# EAGLE design LeonardoCard (EAGLE 6.4)
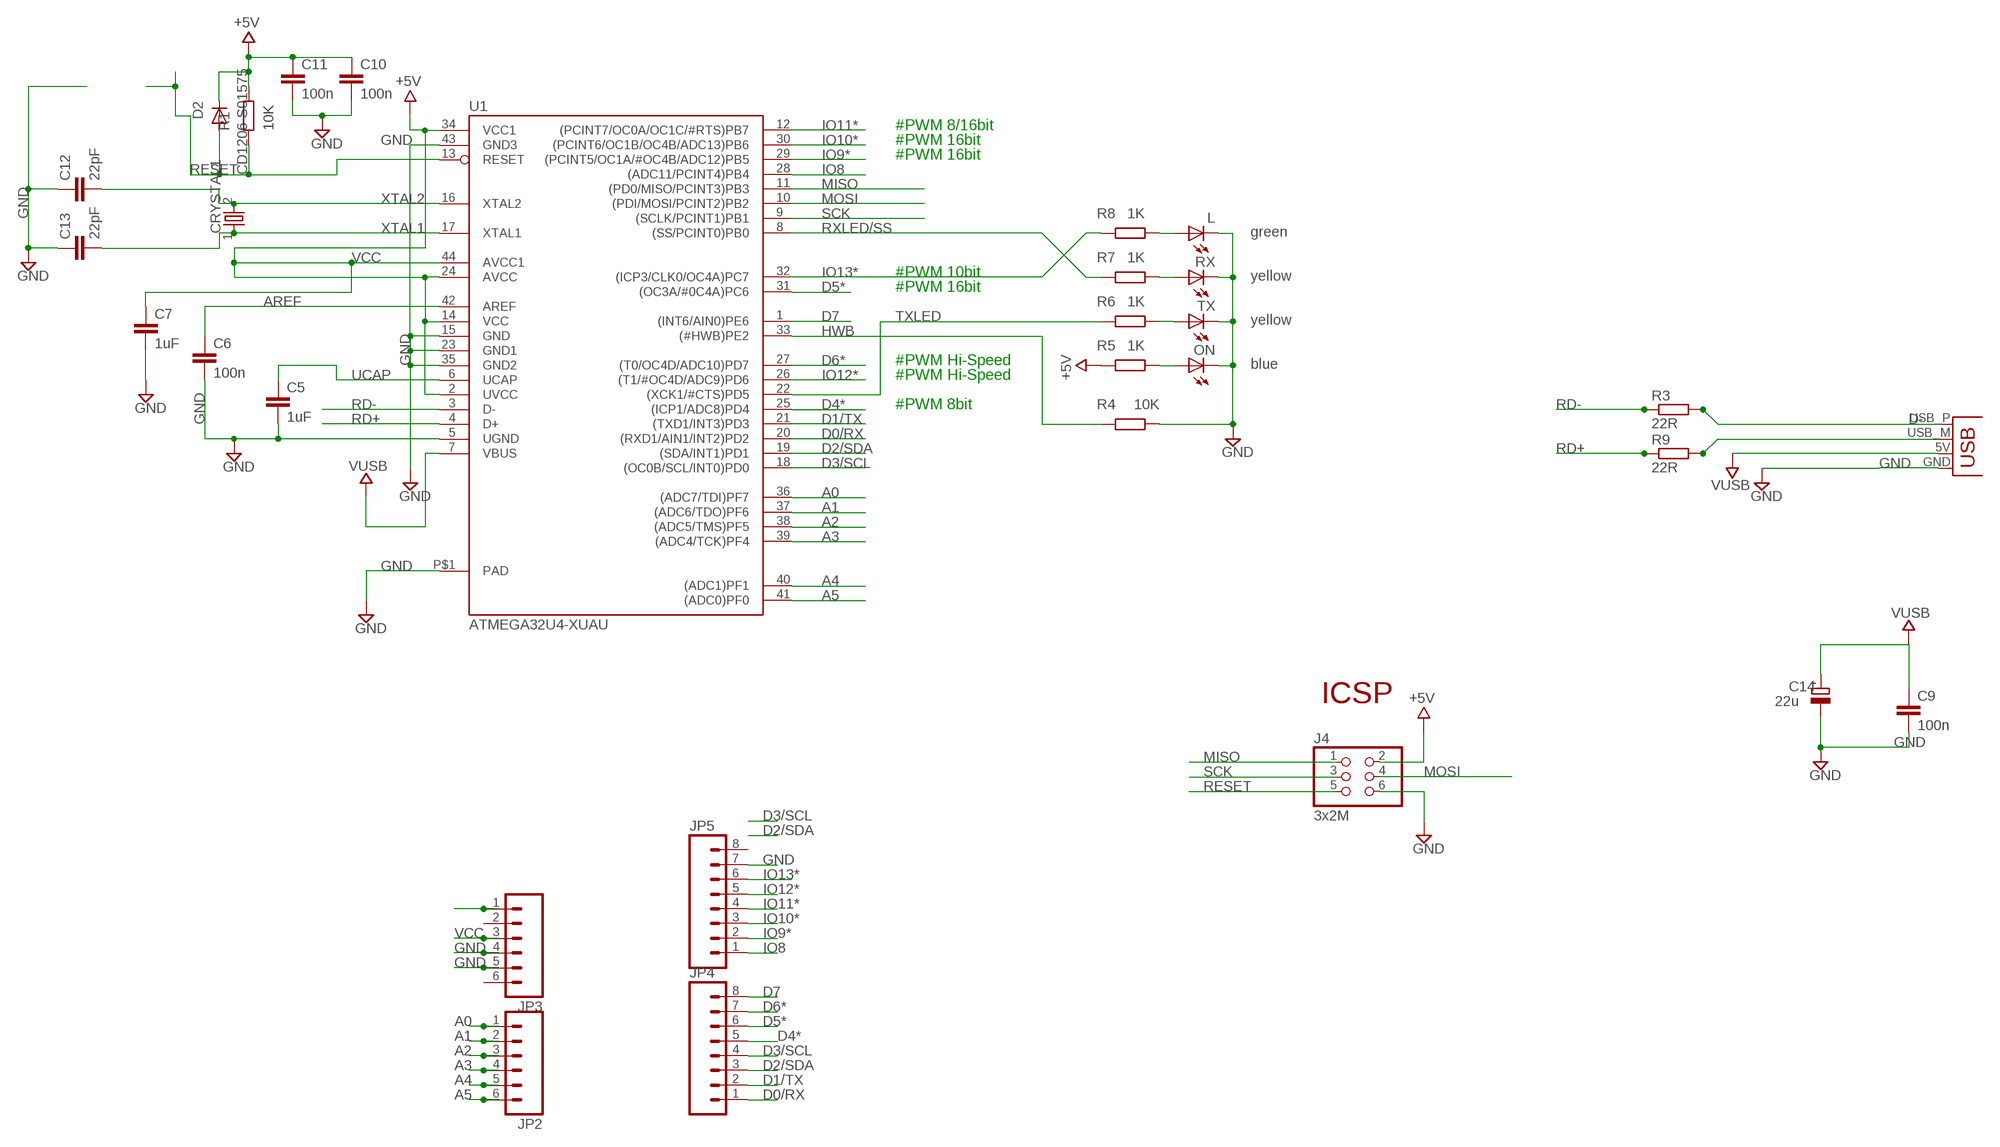
[diagram p0: schematic, sheet 1]

## Parts
C5  1uF  C-EUC1206  [C1206]
C6  100n  C-EUC1206  [C1206]
C7  1uF  C-EUC1206  [C1206]
C9  100n  C-EUC1206  [C1206]
C10  100n  C-EUC1206  [C1206]
C11  100n  C-EUC1206  [C1206]
C12  22pF  C-EUC1206  [C1206]
C13  22pF  C-EUC1206  [C1206]
C14  22u  CPOL-EUSANYO_SMD_B6  [SANYO-OSCON_SMD_B6]
CRYSTAL1  CRYSTAL2PIN  [CRYSTAL-2PIN]
D2  CD1206-S01575  DIODE-SOD80C  [SOD80C]
J4  3x2M  PINHD-2X3  [2X03]
JP1  USBPCB  [USB-A-PCB]
JP2  M06SIP  [1X06]
JP3  M06SIP  [1X06]
JP4  M08NO_SILK  [1X08_NO_SILK]
JP5  M08NO_SILK  [1X08_NO_SILK]
L  green  LEDCHIPLED_1206  [CHIPLED_1206]
ON  blue  LEDCHIPLED_1206  [CHIPLED_1206]
R1  10K  R-EU_R1206  [R1206]
R3  22R  R-EU_R1206  [R1206]
R4  10K  R-EU_R1206  [R1206]
R5  1K  R-EU_R1206  [R1206]
R6  1K  R-EU_R1206  [R1206]
R7  1K  R-EU_R1206  [R1206]
R8  1K  R-EU_R1206  [R1206]
R9  22R  R-EU_R1206  [R1206]
RX  yellow  LEDCHIPLED_1206  [CHIPLED_1206]
TX  yellow  LEDCHIPLED_1206  [CHIPLED_1206]
U1  ATMEGA32U4-XUAU  [TQFP44-PAD]

## Nets
A0: JP2.1 U1.36((ADC7/TDI)PF7)
A1: JP2.2 U1.37((ADC6/TDO)PF6)
A2: JP2.3 U1.38((ADC5/TMS)PF5)
A3: JP2.4 U1.39((ADC4/TCK)PF4)
A4: JP2.5 U1.40((ADC1)PF1)
A5: JP2.6 U1.41((ADC0)PF0)
AREF: C6.1 U1.42(AREF)
D0/RX: JP4.1 U1.20((RXD1/AIN1/INT2)PD2)
D1/TX: JP4.2 U1.21((TXD1/INT3)PD3)
D2/SDA: JP4.3 U1.19((SDA/INT1)PD1)
D3/SCL: JP4.4 U1.18((OC0B/SCL/INT0)PD0)
D4*: JP4.5 U1.25((ICP1/ADC8)PD4)
D5*: JP4.6 U1.31((OC3A/#0C4A)PC6)
D6*: JP4.7 U1.27((T0/OC4D/ADC10)PD7)
D7: JP4.8 U1.1((INT6/AIN0)PE6)
D+: JP1.USB_M(D-) R9.2
D-: JP1.USB_P(D+) R3.2
GND: C5.2 C6.2 C7.2 C9.2 C10.2 C11.2 C12.1 C13.1 C14.- J4.6 JP1.GND JP3.4 JP3.5 JP5.7 L.C ON.C R4.2 RX.C TX.C U1.5(UGND) U1.15(GND) U1.23(GND1) U1.35(GND2) U1.43(GND3) U1.P$1(PAD)
HWB: R4.1 U1.33((#HWB)PE2)
IO8: JP5.1 U1.28((ADC11/PCINT4)PB4)
IO9*: JP5.2 U1.29((PCINT5/OC1A/#OC4B/ADC12)PB5)
IO10*: JP5.3 U1.30((PCINT6/OC1B/OC4B/ADC13)PB6)
IO11*: JP5.4 U1.12((PCINT7/OC0A/OC1C/#RTS)PB7)
IO12*: JP5.5 U1.26((T1/#OC4D/ADC9)PD6)
IO13*: JP5.6 R8.1 U1.32((ICP3/CLK0/OC4A)PC7)
MISO: J4.1 U1.11((PD0/MISO/PCINT3)PB3)
MOSI: J4.4 U1.10((PDI/MOSI/PCINT2)PB2)
N$2: R7.2 RX.A
N$3: ON.A R5.2
N$4: R6.2 TX.A
N$7: L.A R8.2
RD+: R9.1 U1.4(D+)
RD-: R3.1 U1.3(D-)
RESET: D2.A J4.5 JP3.1 R1.2 U1.13(RESET)
RXLED/SS: R7.1 U1.8((SS/PCINT0)PB0)
SCK: J4.3 U1.9((SCLK/PCINT1)PB1)
TXLED: R6.1 U1.22((XCK1/#CTS)PD5)
UCAP: C5.1 U1.6(UCAP)
VCC: C7.1 C9.1 C10.1 C11.1 C14.+ D2.C J4.2 JP1.5V(VBUS) JP3.3 R1.1 R5.1 U1.2(UVCC) U1.14(VCC) U1.24(AVCC) U1.34(VCC1) U1.44(AVCC1) ; supply symbol labelled VUSB, +5V
VUSB: U1.7(VBUS)
XTAL1: C13.2 CRYSTAL1.1 U1.17(XTAL1)
XTAL2: C12.2 CRYSTAL1.2 U1.16(XTAL2)
Unconnected: JP3.2 JP3.6 JP5.8

## Notes on the sheet
- #PWM 8/16bit
- #PWM 16bit
- #PWM 16bit
- #PWM 10bit
- #PWM 16bit
- #PWM Hi-Speed
- #PWM Hi-Speed
- #PWM 8bit
- ICSP

## Library data of the parts
C5-C7 C9-C13 = SmartPrj:C-EU: CAPACITOR, European symbol
C14 = rcl:CPOL-EU: POLARIZED CAPACITOR, European symbol
CRYSTAL1 = BaseApp:CRYSTAL: CRYSTAL SMD-10.5X4.8-2PIN :- http://www.digikey.com/product-detail/en/CX49GFNB12000H0PESZZ/478-4349-1-ND/1532102 SMD-5X3- 4PIN :- 535-11281-1-ND
D2 = diode:DIODE-: DIODE
J4 = SmartPrj:PINHD-2X3: PIN HEADER
JP1 = SparkFun-Connectors:USB: USB Connectors USB-B-PTH is fully proven SKU : PRT-00139/CONN-08278 USB-miniB is fully proven SKU : PRT-00587 USB-A-PCB is untested. USB-A-H is throughly reviewed, but untested. Spark Fun Electronics SKU : PRT-00437 USB-B-SMT is throughly reviewed, but untested. Needs silkscreen touching up. USB-A-S has not been used/tested USB-MB-H has not been used/tested USB-MICROB has been used. CONN-09505
JP2 JP3 = SparkFun-Connectors:M06: Header 6 Standard 6-pin 0.1" header. Use with straight break away headers (SKU : PRT-00116), right angle break away headers (PRT-00553), swiss pins (PRT-00743), machine pins (PRT-00117), and female headers (PRT-00115). Molex polarized connector foot print use with SKU : PRT-08094 with associated crimp pins and housings. NOTES ON THE VARIANTS LOCK and LOCK_LONGPADS... This footprint was designed to help hold the alignment of a through-hole component (i.e. 6-pin header) while soldering it into place. You may notice that each hole has been shifted either up or down by 0.005 of an inch from it's more standard position (which is a perfectly straight line). This slight alteration caused the pins (the squares in the middle) to touch the edges of the holes. Because they are alternating, it causes a "brace" to hold the component in place. 0.005 has proven to be the perfect amount of "off-center" position when using our standard breakaway headers. Although looks a little odd when you look at the bare footprint, once you have a header in there, the alteration is very hard to notice. Also,if you push a header all the way into place, it is covered up entirely on the bottom side. This idea of altering the position of holes to aid alignment will be further integrated into the Sparkfun Library for other footprints. It can help hold any component with 3 or more connection pins.
JP4 JP5 = SparkFun-Connectors:M08: Header 8 Standard 8-pin 0.1" header. Use with straight break away headers (SKU : PRT-00116), right angle break away headers (PRT-00553), swiss pins (PRT-00743), machine pins (PRT-00117), and female headers (PRT-00115).
L ON RX TX = led:LED: LED OSRAM: - CHIPLED LG R971, LG N971, LY N971, LG Q971, LY Q971, LO R971, LY R971 LH N974, LH R974 LS Q976, LO Q976, LY Q976 LO Q996 - Hyper CHIPLED LW Q18S LB Q993, LB Q99A, LB R99A - SideLED LS A670, LO A670, LY A670, LG A670, LP A670 LB A673, LV A673, LT A673, LW A673 LH A674 LY A675 LS A676, LA A676, LO A676, LY A676, LW A676 LS A679, LY A679, LG A679 - Hyper Micro SIDELED® LS Y876, LA Y876, LO Y876, LY Y876 LT Y87S - SmartLED LW L88C, LW L88S LB L89C, LB L89S, LG L890 LS L89K, LO L89K, LY L89K LS L896, LA L896, LO L896, LY L896 - TOPLED LS T670, LO T670, LY T670, LG T670, LP T670 LSG T670, LSP T670, LSY T670, LOP T670, LYG T670 LG T671, LOG T671, LSG T671 LB T673, LV T673, LT T673, LW T673 LH T674 LS T676, LA T676, LO T676, LY T676, LB T676, LH T676, LSB T676, LW T676 LB T67C, LV T67C, LT T67C, LS T67K, LO T67K, LY T67K, LW E67C LS E67B, LA E67B, LO E67B, LY E67B, LB E67C, LV E67C, LT E67C LW T67C LS T679, LY T679, LG T679 LS T770, LO T770, LY T770, LG T770, LP T770 LB T773, LV T773, LT T773, LW T773 LH T774 LS E675, LA E675, LY E675, LS T675 LS T776, LA T776, LO T776, LY T776, LB T776 LHGB T686 LT T68C, LB T68C - Hyper Mini TOPLED® LB M676 - Mini TOPLED Santana® LG M470 LS M47K, LO M47K, LY M47K Source: http://www.osram.convergy.de LUXEON: - LUMILED® LXK2-PW12-R00, LXK2-PW12-S00, LXK2-PW14-U00, LXK2-PW14-V00 LXK2-PM12-R00, LXK2-PM12-S00, LXK2-PM14-U00 LXK2-PE12-Q00, LXK2-PE12-R00, LXK2-PE12-S00, LXK2-PE14-T00, LXK2-PE14-U00 LXK2-PB12-K00, LXK2-PB12-L00, LXK2-PB12-M00, LXK2-PB14-N00, LXK2-PB14-P00, LXK2-PB14-Q00 LXK2-PR12-L00, LXK2-PR12-M00, LXK2-PR14-Q00, LXK2-PR14-R00 LXK2-PD12-Q00, LXK2-PD12-R00, LXK2-PD12-S00 LXK2-PH12-R00, LXK2-PH12-S00 LXK2-PL12-P00, LXK2-PL12-Q00, LXK2-PL12-R00 Source: www.luxeon.com KINGBRIGHT: KA-3528ASYC Source: www.kingbright.com
R1 R4-R8 = SmartPrj:R-EU_: RESISTOR, European symbol
R3 R9 = resistor:R-EU_: RESISTOR, European symbol
U1 = SmartPrj:ATMEGA32U4-XU

## Net classes
0 default: width 0.254 mm, drill 0.61 mm, clearance 0.203 mm

## Board
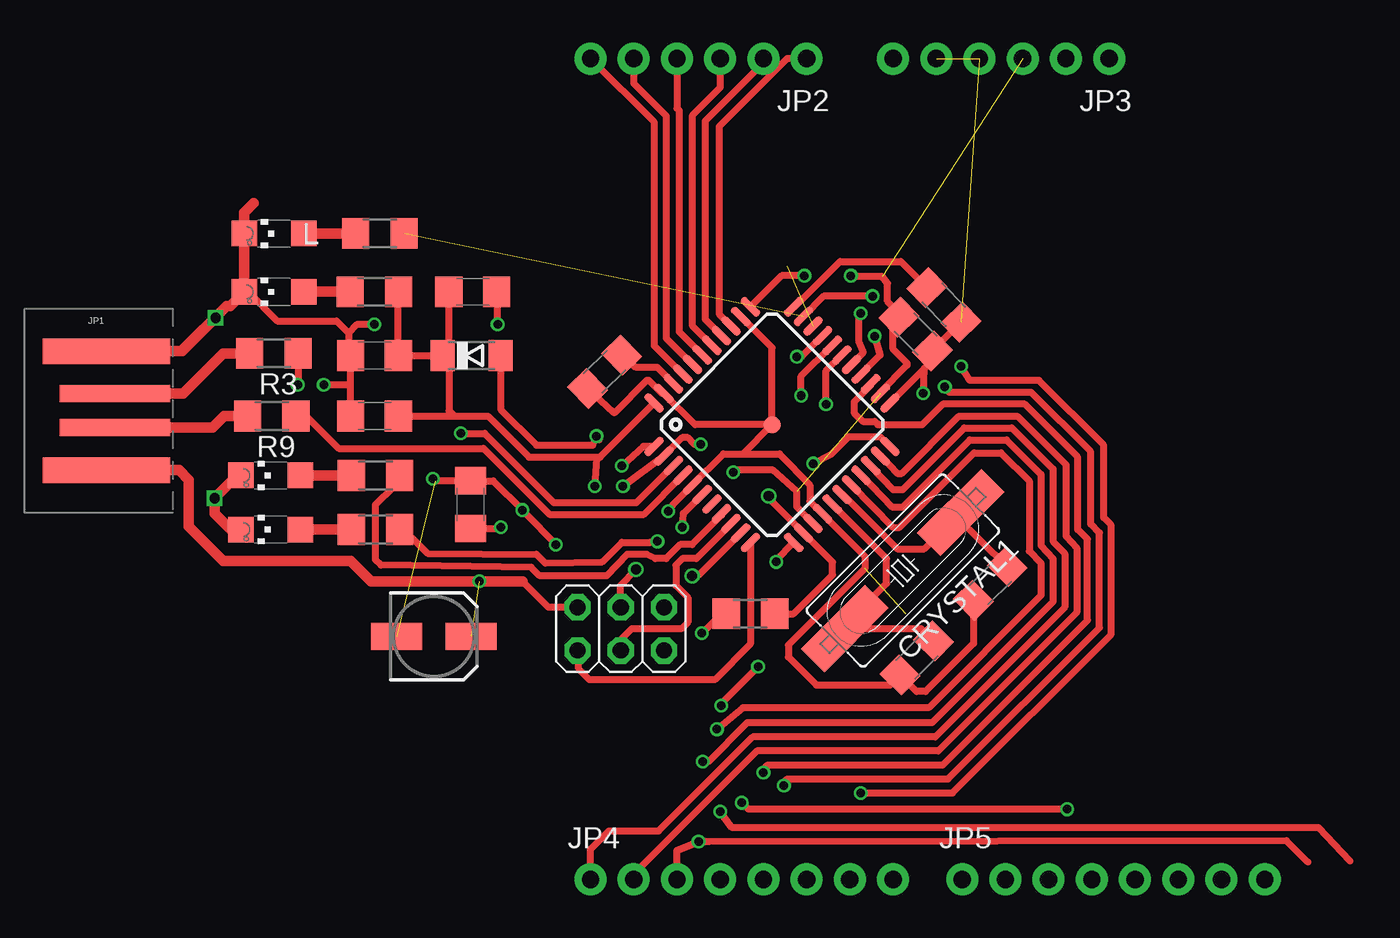
[diagram p1: board, top side]
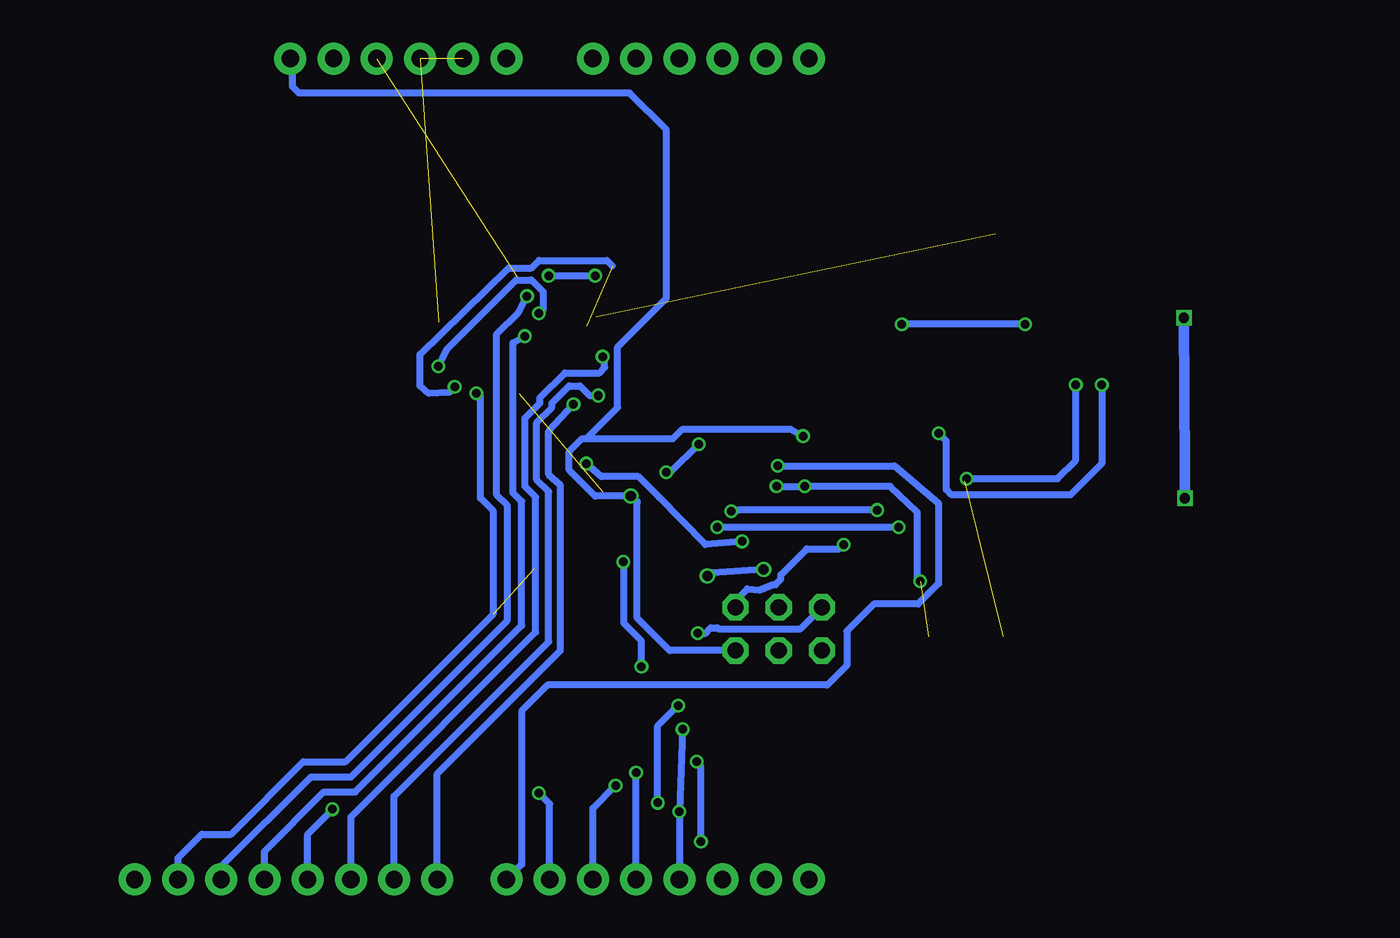
[diagram p2: board, bottom side, seen from below]

No outline drawn. Coordinates in mm, seen from the top.
Copper layers (1*16): Top 0.035mm / dielectric 1.5mm / Bottom 0.035mm
Design rules "dirt_cheap_dirty_boards.v1": minimum track width 5mil, minimum drill 12mil, track to track 5mil, track to pad 5mil, pad to pad 5mil, via to via 5mil, smd to smd 0mil, copper to edge 10mil, drill to drill 10mil, minimum pad ring 10mil, minimum via ring 6mil, stop-mask expansion 2mil, vias tented up to drill 25mil, thermal gap 10mil

### Footprints (pad centres in the part's own frame; a part is rotated, then mirrored left to right if it is on the bottom)
C1206 = smd 1.6 x 1.8: 1 -1.4,0; 2 1.4,0
SANYO-OSCON_SMD_B6 = smd 3 x 1.6: + 2.2,0; - -2.2,0
CRYSTAL-2PIN = smd 5.334 x 1.93: 1 -4.826,0; 2 4.826,0
SOD80C = smd 1.4 x 1.8: A 1.7,0; C -1.7,0
2X03 = drill 0.95 pad 1.55 octagon: 1 -2.54,-1.27; 2 -2.54,1.27; 3 0,-1.27; 4 0,1.27; 5 2.54,-1.27; 6 2.54,1.27
USB-A-PCB = smd 7.5 x 1.5: 5V -0.2,-3.5; GND -0.2,3.5 | smd 6.5 x 1: USB_M 0.3,-1; USB_P 0.3,1
1X06 = drill 1.016 pad 1.88: 1 0,0; 2 2.54,0; 3 5.08,0; 4 7.62,0; 5 10.16,0; 6 12.7,0
1X08_NO_SILK = drill 1.016 pad 1.88: 1 0,0; 2 2.54,0; 3 5.08,0; 4 7.62,0; 5 10.16,0; 6 12.7,0; 7 15.24,0; 8 17.78,0
CHIPLED_1206 = smd 1.5 x 1.5: A 0,-1.75; C 0,1.75
R1206 = smd 1.6 x 1.803: 1 -1.422,0; 2 1.422,0
TQFP44-PAD = smd 1.4 x 0.45: 1 -5.8,4; 2 -5.8,3.2; 3 -5.8,2.4; 4 -5.8,1.6; 5 -5.8,0.8; 6 -5.8,0; 7 -5.8,-0.8; 8 -5.8,-1.6; 9 -5.8,-2.4; 10 -5.8,-3.2; 11 -5.8,-4; 23 5.8,-4; 24 5.8,-3.2; 25 5.8,-2.4; 26 5.8,-1.6; 27 5.8,-0.8; 28 5.8,0; 29 5.8,0.8; 30 5.8,1.6; 31 5.8,2.4; 32 5.8,3.2; 33 5.8,4 | smd 0.45 x 1.4: 12 -4,-5.8; 13 -3.2,-5.8; 14 -2.4,-5.8; 15 -1.6,-5.8; 16 -0.8,-5.8; 17 0,-5.8; 18 0.8,-5.8; 19 1.6,-5.8; 20 2.4,-5.8; 21 3.2,-5.8; 22 4,-5.8; 34 4,5.8; 35 3.2,5.8; 36 2.4,5.8; 37 1.6,5.8; 38 0.8,5.8; 39 0,5.8; 40 -0.8,5.8; 41 -1.6,5.8; 42 -2.4,5.8; 43 -3.2,5.8; 44 -4,5.8 | smd 1 x 1: P$1 0,0

### Placement (x,y rotation side)
C5  -45.15,13.21 90 top
C6  -37.27,21.02 224.5 top
C7  -50.8,18.41 180 top
C9  -18.99,23.24 314.6 top
C10  -45.02,25.72 0 top
C11  -50.8,21.97 180 top
C12  -18.92,4.19 45.4 top
C13  -14.61,8.57 45 top
C14  -47.31,5.46 0 top
CRYSTAL1  -19.75,9.33 225 top
D2  -45.09,21.97 0 top
J4  -36.32,5.91 0 top
JP1  -66.36,18.73 0 top
JP2  -25.4,39.43 180 top
JP3  -7.62,39.43 180 top
JP4  -38.1,-8.83 0 top
JP5  -16.26,-8.83 0 top
L  -56.71,29.15 90 top
ON  -56.71,25.72 90 top
R1  -28.7,6.79 0 top
R3  -56.71,22.1 180 top
R4  -17.34,24.96 314.5 top
R5  -50.8,25.72 180 top
R6  -50.74,11.75 180 top
R7  -50.74,14.92 180 top
R8  -50.48,29.15 180 top
R9  -56.83,18.41 180 top
RX  -56.9,14.92 90 top
TX  -56.9,11.75 90 top
U1  -27.43,17.91 45 top

### Tracks (layer width: path | path; a pad name or v marks a point on that pad's centre or on a via)
A0
  Top 0.406: JP2.1 -26.54,39.43 -30.54,35.43 -30.54,24.41 U1.36
A1
  Top 0.406: JP2.2 -27.94,39.18 -31.37,35.75 -31.37,24.11 U1.37
A2
  Top 0.406: JP2.3 -30.48,37.72 -32.13,36.07 -32.13,23.74 U1.38
A3
  Top 0.406: JP2.4 -33.02,36.51 -32.89,36.39 -32.89,23.37 U1.39
A4
  Top 0.406: JP2.5 -35.56,37.97 -33.66,36.07 -33.66,23 U1.40
A5
  Top 0.406: U1.41 -32.69,20.88 -34.35,22.54 -34.35,35.69 JP2.6
AREF
  Top 0.406: U1.42 -33.23,20.34 -34.16,21.27 -35.42,21.27 C6.1
D0/RX
  Top 0.406: U1.20 -21.63,15.47 -20.32,14.1 -19.75,14.1 -16.13,17.72 -13.34,17.72 -10.92,15.3 -10.92,11.05 -10.22,10.35 -10.22,7.18 -17.84,-0.45 -28.57,-0.45 -34.1,-5.97 -37.02,-5.97 -38.1,-7.05 JP4.1
D1/TX
  Top 0.406: U1.21 -21.02,16.07 -20.07,15.05 -19.81,15.05 -16.45,18.41 -13.02,18.41 -10.16,15.56 -10.16,11.37 -9.53,10.67 -9.53,6.86 -17.65,-1.27 -28.32,-1.27 -35.56,-8.51 JP4.2
D2/SDA  (via drill 0.5)
  Top 0.406: U1.19 -22.18,14.94 -20.38,13.08 -19.75,13.08 -15.81,17.02 -13.65,17.02 -11.62,14.99 -11.62,10.79 -10.92,10.03 -10.92,7.49 -18.03,0.38 -28.89,0.38 -31.18,-1.91 v-31.5,-1.91 | JP4.3 -33.02,-7.11 v-31.75,-6.6 -31.11,-6.6 2.79,-6.54 4.06,-7.81
  Bottom 0.406: v-31.75,-6.6 -31.75,-2.16 v-31.5,-1.91
D3/SCL  (via drill 0.5)
  Top 0.406: U1.18 -22.75,14.37 -20.32,11.87 -19.94,11.87 -15.56,16.26 -13.97,16.26 -12.32,14.61 -12.32,10.48 -11.62,9.78 -11.62,7.87 -18.22,1.27 -29.15,1.27 v-30.67,0 | 6.54,-7.75 4.7,-5.78 -29.78,-5.78 v-30.48,-4.83
  Bottom 0.406: v-30.67,0 v-30.48,-4.83 JP4.4
D4*  (via drill 0.5)
  Top 0.406: v-27.94,-2.54 -27.94,-2.35 -27.69,-2.1 -17.4,-2.1 -8.89,6.41 -8.89,11.18 -9.46,11.75 -9.46,16 -12.57,19.11 -17.4,19.11 -18.61,17.91 -21.21,17.91 -21.4,18.1 -22.1,18.1 -22.61,18.61 -22.61,19.24 -21.63,20.21 U1.25
  Bottom 0.406: JP4.5 v-27.94,-2.54
D5*  (via drill 0.5)  (1 unrouted)
  Top 0.406: v-26.73,-3.3 -26.73,-3.11 -26.54,-2.92 -17.08,-2.92 -8.19,5.97 -8.19,11.56 -8.7,12.06 -8.7,16.32 -12.19,19.81 -17.02,19.81 v-17.27,20.13
  Bottom 0.406: JP4.6 -25.4,-4.64 v-26.73,-3.3 | v-17.27,20.13 -16.95,19.81 -15.75,19.75 -15.24,20.19 -15.24,22.04 -20.45,27.11 -21.78,27.11 -22.23,27.56 -26.23,27.56 -26.54,27.24
D6*  (via drill 0.5)
  Top 0.406: v-22.23,-3.75 -16.83,-3.75 -7.49,5.59 -7.49,12 -7.94,12.45 -7.94,16.7 -11.75,20.51 -15.81,20.51 v-16.32,21.34 | v-22.23,24.45 -22.23,24.32 -22.35,24.13 -22.35,22.86 -22.1,22.23 -22.1,22.11 U1.27
  Bottom 0.406: JP4.7 -22.86,-4.38 v-22.23,-3.75 | v-16.32,21.34 -16.83,22.35 -20.89,26.42 -21.78,26.42 -22.48,25.72 -22.48,24.7 v-22.23,24.45
D7  (via drill 0.5)
  Top 0.406: U1.1 -34.99,16.63 v-36.26,15.49
  Bottom 0.406: v-36.26,15.49 -43.12,15.49 -45.72,13.27 -45.72,8.57 -44.51,7.37 -41.91,7.37 -40.32,5.78 -40.32,3.75 -39.18,2.6 -22.73,2.6 -21.21,1.08 -21.21,-7.94 JP4.8
D+
  Top 0.61: JP1.USB_M -60.31,17.73 -59.63,18.41 R9.2
D-
  Top 0.61: JP1.USB_P -62.06,19.73 -59.69,22.1 R3.2
GND  (via drill 0.5, 0.6)  (4 unrouted)
  Top 0.406: C13.1 -15.6,5.04 -18.41,2.22 -18.93,2.22 C12.1 -20.5,2.6 -24.83,2.6 -26.48,4.25 -26.48,4.95 -21.97,9.46 -21.97,10.16 -24.46,12.65 U1.15 -24.48,12.67 -25.21,13.4 -25.21,14.35 -26.99,16.19 -29.15,16.19 | U1.23 -18.48,21.21 | -18.03,22.08 -18.03,21.65 -18.48,21.21 | -18.03,22.08 C9.2 | U1.P$1 -27.43,22.43 U1.35 | U1.P$1 -31.96,17.91 U1.43 -33.91,19.75 -34.67,20.51 -34.8,20.51 -36.7,18.61 -36.71,18.61 C6.2 | -29.15,16.19 -30.29,16.19 -32.1,14.38 U1.5 -33.24,13.23 v-33.53,12.81 | -29.15,16.19 U1.P$1 | -18.03,22.08 -18.03,22.25 R4.2 | ON.C -58.23,25.72 -56.52,24 -53.02,24 -52.32,23.3 | -52.32,23.3 -52.32,22.09 C11.2 -52.2,20.26 | C7.2 -52.2,20.26 | v-47.37,14.73 -47.25,14.61 C5.2 -43.82,14.61 v-42.1,12.89 -41.91,12.7 v-40.13,10.86 | v-53.78,20.26 -52.2,20.26 | -52.32,23.3 -51.82,23.81 v-50.8,23.81 | v-43.56,23.81 -43.56,25.66 C10.2 | v-18.54,19.75 -18.48,21.21
  Top 0.61: v-60.13,24.19 -62.1,22.23 JP1.GND -62.16,22.23 -59.5,24.89 -59.28,24.89 ON.C L.C -58.46,30.38 -57.91,30.92 | TX.C -58.71,11.68 -59.18,11.68 -60.2,12.7 v-60.2,13.59 -58.86,14.92 RX.C
  Bottom 0.406: v-47.37,14.73 -52.7,14.73 -53.78,15.81 v-53.78,20.26 | v-42.1,12.89 -33.98,12.89 v-33.53,12.81 | v-50.8,23.81 v-43.56,23.81 | J4.6 -33.78,7.56 -34.48,8.26 -35.18,8.19 -36.01,8.51 -36.13,8.51 -36.45,8.83 -36.45,9.08 -37.97,10.6 -39.88,10.6 v-40.13,10.86 | JP5.7 -1.02,-7.56 -2.41,-6.16 -4.13,-6.16 -8.38,-1.91 -10.86,-1.91 -19.56,6.79 -19.56,12.83 -18.8,13.59 -18.8,19.68 v-18.54,19.75
  Bottom 0.61: v-60.13,24.19 -60.2,15.37 v-60.2,13.59
HWB
  Top 0.406: U1.33 -26.09,24.84 -23.43,27.5 -19.86,27.5 R4.1
IO8  (via drill 0.5)
  Top 0.406: v-24.26,19.11 -24.26,21.08 U1.28
  Bottom 0.406: JP5.1 -16.26,-2.6 -23.5,4.64 -23.5,14.35 -22.8,14.99 -22.8,17.53 v-24.26,19.11
IO9*  (via drill 0.5)
  Top 0.406: v-25.72,19.62 -25.72,20.75 U1.29
  Bottom 0.406: JP5.2 -13.72,-3.94 -22.8,5.14 -22.8,13.97 -22.1,14.67 -22.1,18.03 -22.99,18.92 -22.99,19.18 -24,20.19 -24.64,20.19 -25.21,19.62 v-25.72,19.62
IO10*  (via drill 0.5)
  Top 0.406: v-25.97,21.91 -25.69,21.91 U1.30
  Bottom 0.406: JP5.3 -11.18,-5.14 -22.04,5.71 -22.04,13.65 -21.4,14.29 -21.4,18.29 -22.29,19.18 -22.29,19.49 -23.75,20.95 -25.78,20.95 -26.1,21.27 -26.1,21.78 v-25.97,21.91
IO11*  (via drill 0.5)
  Top 0.406: v-10.1,-4.7 -28.83,-4.7 v-29.21,-4.32 | v-30.42,1.4 -30.42,1.52 v-28.26,3.68 | v-27.18,9.84 -27.18,9.96 U1.12
  Bottom 0.406: JP5.4 -8.64,-6.16 v-10.1,-4.7 | v-29.21,-4.32 -29.21,0.19 v-30.42,1.4 | v-28.26,3.68 -28.26,5.21 -27.24,6.22 -27.24,9.78 v-27.18,9.84
IO12*  (via drill 0.5)
  Top 0.406: v-21.4,23.11 -21.08,21.99 U1.26
  Bottom 0.406: JP5.5 -6.1,-7.18 -9.59,-3.68 -11.43,-3.68 -21.21,6.1 -21.21,13.4 -20.7,13.91 -20.7,22.73 v-21.4,23.11
IO13*  (via drill 0.5)  (1 unrouted)
  Top 0.406: v-21.53,25.46 -24.4,25.46 U1.32
  Bottom 0.406: JP5.6 -3.56,-8.06 -8.83,-2.79 -11.18,-2.79 -20.38,6.41 -20.38,13.14 -19.75,13.78 -19.75,23.24 -21.02,24.51 v-21.53,25.46
MISO
  Top 0.406: U1.11 -28.7,5.01 -30.8,2.92 -38.16,2.92 -38.8,3.56 -38.8,4.57 J4.1
MOSI  (via drill 0.6)
  Top 0.406: J4.4 -36.32,8.45 v-35.43,9.4 | v-32.13,9.02 -31.73,9.08 U1.10
  Bottom 0.406: v-35.43,9.4 -32.38,9.21 v-32.13,9.02
N$2
  Top 0.61: RX.A R7.2
N$3
  Top 0.61: ON.A R5.2
N$4
  Top 0.61: TX.A R6.2
N$7
  Top 0.61: L.A R8.2
RD+
  Top 0.406: R9.1 -54.8,18.41 -52.9,16.51 -44.39,16.51 -40.51,12.64 -34.97,12.64 U1.4
RD-  (via drill 0.5)
  Top 0.406: U1.3 -35.4,13.34 -40.26,13.34 -44.32,17.4 v-45.72,17.4 | R3.1 -55.28,20.28 v-55.31,20.26
  Bottom 0.406: v-55.31,20.26 -55.31,15.62 -53.47,13.78 -46.48,13.78 -46.16,14.1 -46.16,16.95 v-45.72,17.4
RESET  (via drill 0.5, 0.6)
  Top 0.406: v-27.62,13.72 -27.62,13.57 U1.13 -23.88,9.83 -23.88,9.08 -26.16,6.79 R1.2 | D2.A -43.38,18.81 -41.27,16.7 -37.97,16.7 v-37.75,17.24 -37.59,17.02
  Bottom 0.406: J4.5 -29.91,4.64 -28,6.54 -28,13.34 | -28,13.34 v-27.62,13.72 | -28,13.34 -28,13.4 -27.69,13.72 -25.53,13.72 -24,15.24 -24,16.32 -24.77,17.08 -25.02,17.08 | -25.02,17.08 -30.1,17.08 -30.67,17.65 -37.02,17.65 v-37.75,17.24 | -25.02,17.08 -26.86,18.92 -26.86,22.48 -29.72,25.34 -29.72,35.24 -27.56,37.4 -8.13,37.4 -7.75,37.78 -7.75,39.31 JP3.1
RXLED/SS
  Top 0.406: U1.8 -30.4,12.59 -32.13,10.86 -32.83,10.86 -33.66,10.03 -34.29,10.03 -34.8,10.29 -35.94,10.29 -37.15,9.02 -41.08,9.02 -41.59,9.53 -50.42,9.65 -50.74,9.97 -50.74,13.21 -49.66,14.29 -49.66,14.58 R7.1
SCK
  Top 0.406: U1.9 -29.84,12.07 -31.88,10.03 -32.7,10.03 -33.08,9.65 -33.08,8.45 -32.38,7.75 -32.38,6.29 -32.77,5.91 -35.69,5.91 -36.26,5.33 -36.26,4.7 J4.3
TXLED  (via drill 0.5)
  Top 0.406: R6.1 -49.09,11.75 -47.69,10.35 -41.27,10.29 -40.77,9.78 -37.4,9.84 -36.26,10.99 -34.61,10.99 v-34.16,11.05 | v-25.02,15.62 -23.94,16.19 -22.92,17.21 -21.08,17.21 U1.22
  Bottom 0.406: v-34.16,11.05 -32,10.86 -29.27,13.65 -28.07,14.86 -25.91,14.86 v-25.02,15.62
UCAP  (via drill 0.5)
  Top 0.406: C5.1 -43.44,11.81 v-43.37,11.87 | v-32.7,11.87 -32.64,12.7 U1.6
  Bottom 0.406: v-43.37,11.87 v-32.7,11.87
VCC  (via drill 0.5)  (3 unrouted)
  Top 0.406: U1.24 -21.07,19.83 -19.49,21.4 -19.49,21.53 -20.32,22.35 -20.32,23.89 C9.1 | -20.32,23.95 C9.1 | J4.2 -40.58,7.18 -42.1,8.7 | v-22.8,26.67 -22.73,26.61 -20.95,26.61 -20.64,26.23 -20.64,25.15 -19.97,24.48 C9.1 | v-25.53,26.67 -26.87,26.67 U1.34 | v-36.2,14.29 -33.8,16.05 U1.2 -32.72,17.14 -32.38,17.14 -32,16.76 v-31.62,16.76 | C7.1 -46.1,18.41 | -46.1,18.41 -44.13,18.41 -41.72,16 -37.78,16 | -37.78,16 -37.54,16 U1.44 | U1.14 -25.06,12.11 -25.97,13.08 -25.97,13.97 -27.37,15.24 -29.59,15.24 v-29.72,15.11 | v-37.85,14.29 -37.72,15.94 -37.78,16 | R5.1 -49.4,25.7 C11.1 D2.C -46.42,21.97 | -46.42,21.97 C10.1 | -46.42,21.97 -46.42,18.73 -46.1,18.41 | R1.1 -30.42,6.79 v-31.56,5.65
  Top 0.61: -42.1,8.7 v-44.64,8.7 -50.99,8.7 -52.2,9.91 -59.69,9.91 -61.72,11.94 -61.72,14.67 -62.29,15.23 JP1.5V
  Bottom 0.406: v-22.8,26.67 v-25.53,26.67 | v-36.2,14.29 v-37.85,14.29 -42.86,14.29 -44.45,12.76 -44.45,8.89 v-44.64,8.7 | v-29.72,15.11 -29.97,15.11 v-31.62,16.76 | v-31.56,5.65 -32,5.65 -32.32,5.97 -32.7,5.97 -32.77,5.91 -37.59,5.91 J4.2
XTAL1
  Top 0.406: C13.2 -16.65,12.54 CRYSTAL1.1 -18.48,10.6 -20.07,10.6 -23.27,13.81 U1.17
XTAL2
  Top 0.406: C12.2 -18.67,5.92 CRYSTAL1.2 -23.16,6.11 -20.7,8.57 -20.7,10.04 U1.16

### Text on the board
tPlace: ICSP